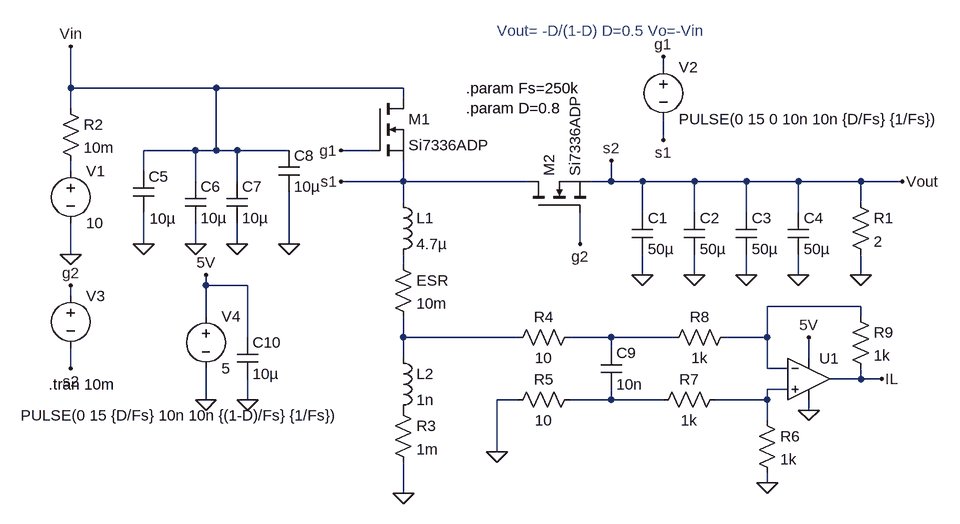
[diagram p0: schematic BuckBoost.asc]
BuckBoost.asc, the LTspice schematic file:
Version 4
SHEET 1 1052 680
WIRE 576 -16 576 -32
WIRE -336 16 -336 -48
WIRE -112 16 -336 16
WIRE 176 16 -112 16
WIRE 176 32 176 16
WIRE -336 48 -336 16
WIRE 576 96 576 64
WIRE -144 112 -224 112
WIRE -112 112 -112 16
WIRE -112 112 -144 112
WIRE -80 112 -112 112
WIRE 0 112 -80 112
WIRE 128 112 80 112
WIRE -336 144 -336 128
WIRE -224 144 -224 112
WIRE -144 160 -144 112
WIRE -80 160 -80 112
WIRE 176 160 176 128
WIRE 176 160 80 160
WIRE 368 160 176 160
WIRE 496 160 496 128
WIRE 496 160 464 160
WIRE 544 160 496 160
WIRE 624 160 544 160
WIRE 704 160 624 160
WIRE 784 160 704 160
WIRE 880 160 784 160
WIRE 944 160 880 160
WIRE 176 192 176 160
WIRE 880 192 880 160
WIRE 544 208 544 160
WIRE 624 208 624 160
WIRE 704 208 704 160
WIRE 784 208 784 160
WIRE -224 256 -224 208
WIRE -144 256 -144 224
WIRE -80 256 -80 224
WIRE 0 256 0 176
WIRE 448 256 448 208
WIRE -336 272 -336 224
WIRE 176 288 176 272
WIRE 544 304 544 272
WIRE 624 304 624 272
WIRE 704 304 704 272
WIRE 784 304 784 272
WIRE 880 304 880 272
WIRE -128 320 -128 304
WIRE -64 320 -128 320
WIRE -336 336 -336 320
WIRE 880 352 736 352
WIRE -128 368 -128 320
WIRE 880 368 880 352
WIRE -64 400 -64 320
WIRE 176 400 176 368
WIRE 352 400 176 400
WIRE 496 400 432 400
WIRE 592 400 496 400
WIRE 736 400 736 352
WIRE 736 400 672 400
WIRE 496 416 496 400
WIRE 176 432 176 400
WIRE 800 432 800 400
WIRE -336 448 -336 416
WIRE 736 448 736 400
WIRE 768 448 736 448
WIRE 880 464 880 448
WIRE 880 464 832 464
WIRE 912 464 880 464
WIRE 768 480 736 480
WIRE -128 496 -128 448
WIRE -64 496 -64 464
WIRE 352 496 320 496
WIRE 496 496 496 480
WIRE 496 496 432 496
WIRE 576 496 496 496
WIRE 736 496 736 480
WIRE 736 496 656 496
WIRE 800 512 800 496
WIRE 736 528 736 496
WIRE 320 576 320 496
WIRE 736 624 736 608
WIRE 176 640 176 592
FLAG 176 640 0
FLAG 80 112 g1
FLAG 80 160 s1
FLAG 544 304 0
FLAG 880 304 0
FLAG 944 160 Vout
FLAG -336 272 0
FLAG -224 256 0
FLAG -144 256 0
FLAG -80 256 0
FLAG 0 256 0
FLAG 576 -32 g1
FLAG 576 96 s1
FLAG -336 -48 Vin
FLAG 448 256 g2
FLAG 496 128 s2
FLAG -336 320 g2
FLAG -336 448 s2
FLAG 624 304 0
FLAG 704 304 0
FLAG 784 304 0
FLAG -128 496 0
FLAG -64 496 0
FLAG -128 304 5V
FLAG 800 400 5V
FLAG 800 512 0
FLAG 912 464 IL
FLAG 736 624 0
FLAG 320 576 0
SYMBOL voltage -336 128 R0
SYMATTR InstName V1
SYMATTR Value 10
SYMBOL nmos 128 32 R0
SYMATTR InstName M1
SYMATTR Value Si7336ADP
SYMBOL ind 160 176 R0
SYMATTR InstName L1
SYMATTR Value 4.7µ
SYMBOL cap 528 208 R0
SYMATTR InstName C1
SYMATTR Value 50µ
SYMBOL res 864 176 R0
SYMATTR InstName R1
SYMATTR Value 2
SYMBOL cap -240 144 R0
WINDOW 3 25 73 Left 2
SYMATTR InstName C5
SYMATTR Value 10µ
SYMBOL cap -160 160 R0
SYMATTR InstName C6
SYMATTR Value 10µ
SYMBOL cap -96 160 R0
SYMATTR InstName C7
SYMATTR Value 10µ
SYMBOL cap -16 112 R0
SYMATTR InstName C8
SYMATTR Value 10µ
SYMBOL voltage 576 -32 R0
WINDOW 123 0 0 Left 0
WINDOW 39 0 0 Left 0
SYMATTR InstName V2
SYMATTR Value PULSE(0 15 0 10n 10n {D/Fs} {1/Fs})
SYMBOL res -352 32 R0
SYMATTR InstName R2
SYMATTR Value 10m
SYMBOL nmos 368 208 R270
SYMATTR InstName M2
SYMATTR Value Si7336ADP
SYMBOL voltage -336 320 R0
WINDOW 3 -77 200 Left 2
WINDOW 123 0 0 Left 0
WINDOW 39 0 0 Left 0
SYMATTR InstName V3
SYMATTR Value PULSE(0 15 {D/Fs} 10n 10n {(1-D)/Fs} {1/Fs})
SYMBOL cap 608 208 R0
SYMATTR InstName C2
SYMATTR Value 50µ
SYMBOL cap 688 208 R0
SYMATTR InstName C3
SYMATTR Value 50µ
SYMBOL cap 768 208 R0
SYMATTR InstName C4
SYMATTR Value 50µ
SYMBOL res 160 496 R0
SYMATTR InstName R3
SYMATTR Value 1m
SYMBOL res 448 384 R90
WINDOW 0 0 56 VBottom 2
WINDOW 3 32 56 VTop 2
SYMATTR InstName R4
SYMATTR Value 10
SYMBOL res 448 480 R90
WINDOW 0 0 56 VBottom 2
WINDOW 3 32 56 VTop 2
SYMATTR InstName R5
SYMATTR Value 10
SYMBOL cap 480 416 R0
SYMATTR InstName C9
SYMATTR Value 10n
SYMBOL OpAmps\\UniversalOpamp2 800 464 R0
SYMATTR InstName U1
SYMBOL voltage -128 352 R0
SYMATTR InstName V4
SYMATTR Value 5
SYMBOL cap -80 400 R0
SYMATTR InstName C10
SYMATTR Value 10µ
SYMBOL res 720 512 R0
SYMATTR InstName R6
SYMATTR Value 1k
SYMBOL res 672 480 R90
WINDOW 0 0 56 VBottom 2
WINDOW 3 32 56 VTop 2
SYMATTR InstName R7
SYMATTR Value 1k
SYMBOL res 688 384 R90
WINDOW 0 0 56 VBottom 2
WINDOW 3 32 56 VTop 2
SYMATTR InstName R8
SYMATTR Value 1k
SYMBOL res 864 352 R0
SYMATTR InstName R9
SYMATTR Value 1k
SYMBOL ind 160 416 R0
SYMATTR InstName L2
SYMATTR Value 1n
SYMBOL res 160 272 R0
SYMATTR InstName ESR
SYMATTR Value 10m
TEXT 272 16 Left 2 !.param Fs=250k\n.param D=0.8
TEXT 320 -72 Left 2 ;Vout= -D/(1-D) D=0.5 Vo=-Vin
TEXT -370 472 Left 2 !.tran 10m

The netlist it stands for:
* BuckBoost.asc
V1 N001 0 10
M1 Vin g1 s1 s1 Si7336ADP
L1 s1 N002 4.7µ
C1 s2 0 50µ
R1 s2 0 2
C5 Vin 0 10µ
C6 Vin 0 10µ
C7 Vin 0 10µ
C8 Vin 0 10µ
V2 g1 s1 PULSE(0 15 0 10n 10n {D/Fs} {1/Fs})
R2 Vin N001 10m
M2 s1 g2 s2 s2 Si7336ADP
V3 g2 s2 PULSE(0 15 {D/Fs} 10n 10n {(1-D)/Fs} {1/Fs})
C2 s2 0 50µ
C3 s2 0 50µ
C4 s2 0 50µ
R3 P001 0 1m
R4 N005 N004 10
R5 N007 0 10
C9 N005 N007 10n
XU1 N006 N003 5V 0 IL level.2 Avol=1Meg GBW=10Meg Slew=10Meg ilimit=25m rail=0 Vos=0 phimargin=45 en=0 enk=0 in=0 ink=0 Rin=500Meg  ; pins IN+ IN- V+ V- OUT
V4 5V 0 5
C10 5V 0 10µ
R6 N006 0 1k
R7 N006 N007 1k
R8 N003 N005 1k
R9 N003 IL 1k
L2 N004 P001 1n
R§ESR N002 N004 10m
.model NMOS NMOS
.model PMOS PMOS
.lib standard.mos
.param Fs=250k
.param D=0.8
* Vout= -D/(1-D) D=0.5 Vo=-Vin
.tran 10m
.lib UniversalOpamps2.sub
.backanno
.end